# EAGLE design Skaarhoj BI10-2x5RGB (EAGLE 6.2)

## Sheet 1 of 2
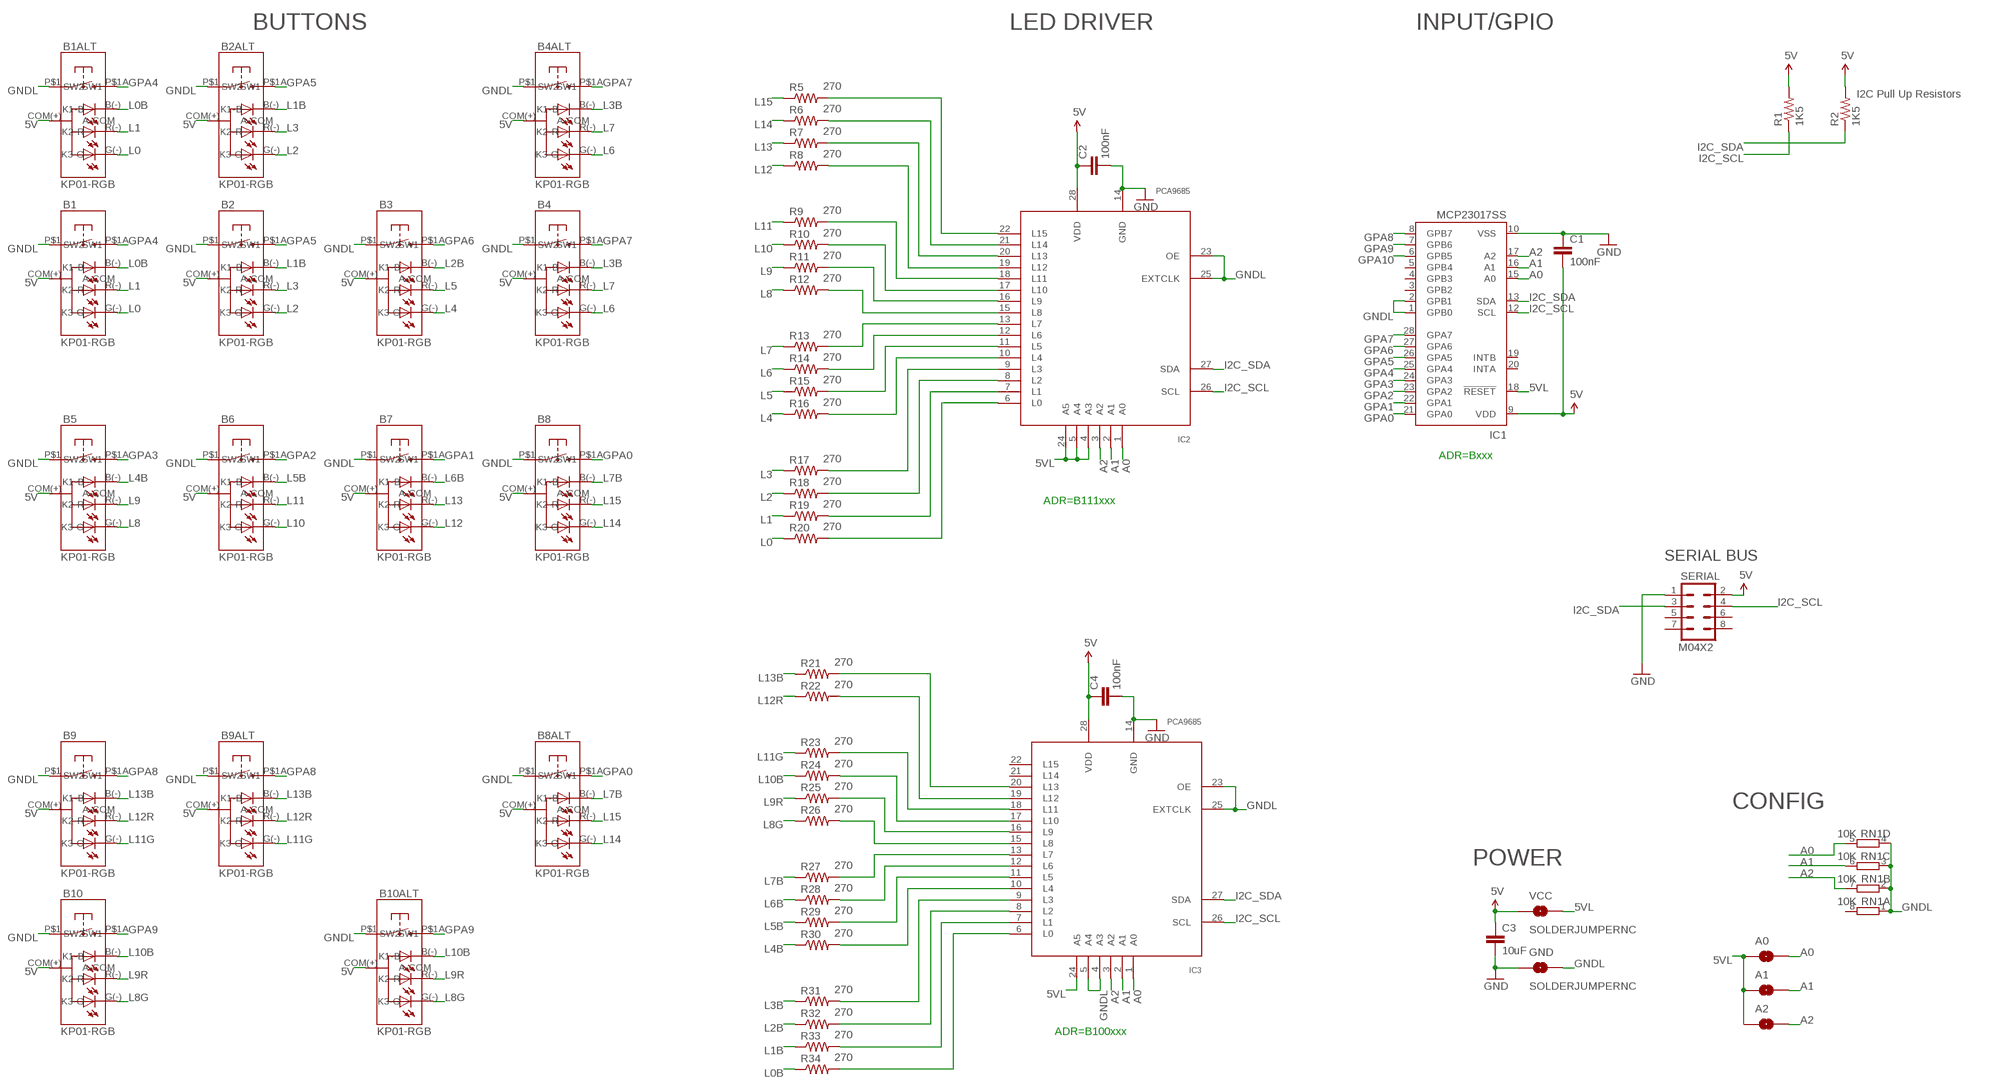
[diagram p0: schematic, sheet 1]

### Parts
A0  SOLDERJUMPERNC  [SJ_2S]
A1  SOLDERJUMPERNC  [SJ_2S]
A2  SOLDERJUMPERNC  [SJ_2S]
B1  KP01-RGB  NKK-KP01  [NKK-KP01]
B1ALT  KP01-RGB  NKK-KP01  [NKK-KP01]
B2  KP01-RGB  NKK-KP01  [NKK-KP01]
B2ALT  KP01-RGB  NKK-KP01  [NKK-KP01]
B3  KP01-RGB  NKK-KP01  [NKK-KP01]
B4  KP01-RGB  NKK-KP01  [NKK-KP01]
B4ALT  KP01-RGB  NKK-KP01  [NKK-KP01]
B5  KP01-RGB  NKK-KP01  [NKK-KP01]
B6  KP01-RGB  NKK-KP01  [NKK-KP01]
B7  KP01-RGB  NKK-KP01  [NKK-KP01]
B8  KP01-RGB  NKK-KP01  [NKK-KP01]
B8ALT  KP01-RGB  NKK-KP01  [NKK-KP01]
B9  KP01-RGB  NKK-KP01  [NKK-KP01]
B9ALT  KP01-RGB  NKK-KP01  [NKK-KP01]
B10  KP01-RGB  NKK-KP01  [NKK-KP01]
B10ALT  KP01-RGB  NKK-KP01  [NKK-KP01]
C1  100nF  CAP0603-CAP  [0603-CAP]
C2  100nF  CAP0603-CAP  [0603-CAP]
C3  10uF  CAP0805  [0805]
C4  100nF  CAP0603-CAP  [0603-CAP]
GND  SOLDERJUMPERNC  [SJ_2S]
IC1  MCP23017SS  [SSOP28]
IC2  PCA9685  [TSSOP28]
IC3  PCA9685  [TSSOP28]
R1  1K5  RESISTOR0603-RES  [0603-RES]
R2  1K5  RESISTOR0603-RES  [0603-RES]
R5  270  RESISTOR0603-RES  [0603-RES]
R6  270  RESISTOR0603-RES  [0603-RES]
R7  270  RESISTOR0603-RES  [0603-RES]
R8  270  RESISTOR0603-RES  [0603-RES]
R9  270  RESISTOR0603-RES  [0603-RES]
R10  270  RESISTOR0603-RES  [0603-RES]
R11  270  RESISTOR0603-RES  [0603-RES]
R12  270  RESISTOR0603-RES  [0603-RES]
R13  270  RESISTOR0603-RES  [0603-RES]
R14  270  RESISTOR0603-RES  [0603-RES]
R15  270  RESISTOR0603-RES  [0603-RES]
R16  270  RESISTOR0603-RES  [0603-RES]
R17  270  RESISTOR0603-RES  [0603-RES]
R18  270  RESISTOR0603-RES  [0603-RES]
R19  270  RESISTOR0603-RES  [0603-RES]
R20  270  RESISTOR0603-RES  [0603-RES]
R21  270  RESISTOR0603-RES  [0603-RES]
R22  270  RESISTOR0603-RES  [0603-RES]
R23  270  RESISTOR0603-RES  [0603-RES]
R24  270  RESISTOR0603-RES  [0603-RES]
R25  270  RESISTOR0603-RES  [0603-RES]
R26  270  RESISTOR0603-RES  [0603-RES]
R27  270  RESISTOR0603-RES  [0603-RES]
R28  270  RESISTOR0603-RES  [0603-RES]
R29  270  RESISTOR0603-RES  [0603-RES]
R30  270  RESISTOR0603-RES  [0603-RES]
R31  270  RESISTOR0603-RES  [0603-RES]
R32  270  RESISTOR0603-RES  [0603-RES]
R33  270  RESISTOR0603-RES  [0603-RES]
R34  270  RESISTOR0603-RES  [0603-RES]
RN1  10K  4R-NCAY16  [CAY16_HAND]
SERIAL  M04X2  [2X4]
VCC  SOLDERJUMPERNC  [SJ_2S]

### Nets
5V [Power]: B1.COM(+)(A-COM) B1ALT.COM(+)(A-COM) B2.COM(+)(A-COM) B2ALT.COM(+)(A-COM) B3.COM(+)(A-COM) B4.COM(+)(A-COM) B4ALT.COM(+)(A-COM) B5.COM(+)(A-COM) B6.COM(+)(A-COM) B7.COM(+)(A-COM) B8.COM(+)(A-COM) B8ALT.COM(+)(A-COM) B9.COM(+)(A-COM) B9ALT.COM(+)(A-COM) B10.COM(+)(A-COM) B10ALT.COM(+)(A-COM) C1.2 C2.1 C3.1 C4.1 IC1.9(VDD) IC2.28(VDD) IC3.28(VDD) R1.2 R2.2 SERIAL.2 VCC.1
5VL: A0.1 A1.1 A2.1 IC1.18(!RESET) IC2.4(A3) IC2.5(A4) IC2.24(A5) IC3.24(A5) VCC.2
A0: A0.2 IC1.15(A0) IC2.1(A0) IC3.1(A0) RN1.5
A1: A1.2 IC1.16(A1) IC2.2(A1) IC3.2(A1) RN1.6
A2: A2.2 IC1.17(A2) IC2.3(A2) IC3.3(A2) RN1.7
GND [Power]: C1.1 C2.2 C3.2 C4.2 GND.1 IC1.10(VSS) IC2.14(GND) IC3.14(GND) SERIAL.1
GNDL: B1.P$1(SW1) B1ALT.P$1(SW1) B2.P$1(SW1) B2ALT.P$1(SW1) B3.P$1(SW1) B4.P$1(SW1) B4ALT.P$1(SW1) B5.P$1(SW1) B6.P$1(SW1) B7.P$1(SW1) B8.P$1(SW1) B8ALT.P$1(SW1) B9.P$1(SW1) B9ALT.P$1(SW1) B10.P$1(SW1) B10ALT.P$1(SW1) GND.2 IC1.1(GPB0) IC1.2(GPB1) IC2.23(OE) IC2.25(EXTCLK) IC3.4(A3) IC3.5(A4) IC3.23(OE) IC3.25(EXTCLK) RN1.1 RN1.2 RN1.3 RN1.4
GPA0: B8.P$1A(SW2) B8ALT.P$1A(SW2) IC1.21(GPA0)
GPA1: B7.P$1A(SW2) IC1.22(GPA1)
GPA2: B6.P$1A(SW2) IC1.23(GPA2)
GPA3: B5.P$1A(SW2) IC1.24(GPA3)
GPA4: B1.P$1A(SW2) B1ALT.P$1A(SW2) IC1.25(GPA4)
GPA5: B2.P$1A(SW2) B2ALT.P$1A(SW2) IC1.26(GPA5)
GPA6: B3.P$1A(SW2) IC1.27(GPA6)
GPA7: B4.P$1A(SW2) B4ALT.P$1A(SW2) IC1.28(GPA7)
GPA8: B9.P$1A(SW2) B9ALT.P$1A(SW2) IC1.8(GPB7)
GPA9: B10.P$1A(SW2) B10ALT.P$1A(SW2) IC1.7(GPB6)
GPA10: IC1.6(GPB5)
I2C_SCL: IC1.12(SCL) IC2.26(SCL) IC3.26(SCL) R1.1 SERIAL.4
I2C_SDA: IC1.13(SDA) IC2.27(SDA) IC3.27(SDA) R2.1 SERIAL.3
L0: B1.G(-)(K3-G) B1ALT.G(-)(K3-G) R20.1
L0B: B1.B(-)(K1-B) B1ALT.B(-)(K1-B) R34.1
L1: B1.R(-)(K2-R) B1ALT.R(-)(K2-R) R19.1
L1B: B2.B(-)(K1-B) B2ALT.B(-)(K1-B) R33.1
L2: B2.G(-)(K3-G) B2ALT.G(-)(K3-G) R18.1
L2B: B3.B(-)(K1-B) R32.1
L3: B2.R(-)(K2-R) B2ALT.R(-)(K2-R) R17.1
L3B: B4.B(-)(K1-B) B4ALT.B(-)(K1-B) R31.1
L4: B3.G(-)(K3-G) R16.1
L4B: B5.B(-)(K1-B) R30.1
L5: B3.R(-)(K2-R) R15.1
L5B: B6.B(-)(K1-B) R29.1
L6: B4.G(-)(K3-G) B4ALT.G(-)(K3-G) R14.1
L6B: B7.B(-)(K1-B) R28.1
L7: B4.R(-)(K2-R) B4ALT.R(-)(K2-R) R13.1
L7B: B8.B(-)(K1-B) B8ALT.B(-)(K1-B) R27.1
L8: B5.G(-)(K3-G) R12.1
L8G: B10.G(-)(K3-G) B10ALT.G(-)(K3-G) R26.1
L9: B5.R(-)(K2-R) R11.1
L9R: B10.R(-)(K2-R) B10ALT.R(-)(K2-R) R25.1
L10: B6.G(-)(K3-G) R10.1
L10B: B10.B(-)(K1-B) B10ALT.B(-)(K1-B) R24.1
L11: B6.R(-)(K2-R) R9.1
L11G: B9.G(-)(K3-G) B9ALT.G(-)(K3-G) R23.1
L12: B7.G(-)(K3-G) R8.1
L12R: B9.R(-)(K2-R) B9ALT.R(-)(K2-R) R22.1
L13: B7.R(-)(K2-R) R7.1
L13B: B9.B(-)(K1-B) B9ALT.B(-)(K1-B) R21.1
L14: B8.G(-)(K3-G) B8ALT.G(-)(K3-G) R6.1
L15: B8.R(-)(K2-R) B8ALT.R(-)(K2-R) R5.1
N$2: IC3.13(L7) R27.2
N$3: IC3.12(L6) R28.2
N$4: IC2.13(L7) R13.2
N$5: IC2.12(L6) R14.2
N$6: IC3.11(L5) R29.2
N$7: IC2.11(L5) R15.2
N$9: IC2.10(L4) R16.2
N$10: IC2.9(L3) R17.2
N$11: IC2.8(L2) R18.2
N$12: IC2.7(L1) R19.2
N$13: IC3.10(L4) R30.2
N$14: IC3.9(L3) R31.2
N$15: IC3.8(L2) R32.2
N$16: IC3.7(L1) R33.2
N$17: IC3.6(L0) R34.2
N$18: IC3.15(L8) R26.2
N$19: IC2.6(L0) R20.2
N$20: IC2.15(L8) R12.2
N$21: IC2.16(L9) R11.2
N$22: IC2.17(L10) R10.2
N$23: IC2.18(L11) R9.2
N$24: IC2.19(L12) R8.2
N$25: IC2.20(L13) R7.2
N$26: IC2.21(L14) R6.2
N$27: IC2.22(L15) R5.2
N$28: IC3.16(L9) R25.2
N$29: IC3.17(L10) R24.2
N$30: IC3.18(L11) R23.2
N$31: IC3.19(L12) R22.2
N$32: IC3.20(L13) R21.2
Unconnected: IC1.3(GPB2) IC1.4(GPB3) IC1.5(GPB4) IC1.19(INTB) IC1.20(INTA) IC3.21(L14) IC3.22(L15) RN1.8 SERIAL.5 SERIAL.6 SERIAL.7 SERIAL.8

### Notes on the sheet
- BUTTONS | LED DRIVER | INPUT/GPIO
- I2C Pull Up Resistors
- ADR=Bxxx
- ADR=B111xxx
- SERIAL BUS
- CONFIG
- POWER
- ADR=B100xxx

## Sheet 2 of 2

## Library data of the parts
A0 A1 A2 GND VCC = SparkFun:SOLDERJUMPER: Solder Jumper Standard SMD solder jumper. Used to automate production. Two varients : Normally Open and Normally Closed are the same, but have different paste layers. NC will have a large amount of paste and should jumper during reflow.
B1 B1ALT B2 B2ALT B3 B4 B4ALT B5-B8 B8ALT B9 B9ALT B10 B10ALT = SKAARHOJ:NKK-KP01: NKK-KP01-15AC 100mA12VDC
C1-C4 = SparkFun:CAP: Capacitor Standard 0603 ceramic capacitor, and 0.1" leaded capacitor.
IC1 = microchip:MCP23017: http://ww1.microchip.com/downloads/en/DeviceDoc/21952a.pdf Source: http://ww1.microchip.com/downloads/en/DeviceDoc/21952a.pdf; MF: MICROCHIP; MPN: MCP23017-E/SS; OC_FARNELL: 1467674; OC_NEWARK: 31K2960
IC2 IC3 = wsmith:PCA9685
R1 R2 R5-R34 = SparkFun:RESISTOR: Resistor Basic schematic elements and footprints for 0603, 1206, and PTH resistors.
RN1 = SKAARHOJ:4R-N: Array Chip Resistor Source: RS Component / Phycomp; OC_FARNELL: unknown; OC_NEWARK: unknown
SERIAL = SparkFun:M04X2

## Net classes
0 default: width 0.152 mm, drill 0.254 mm, clearance 0.152 mm
1 Power: width 0.406 mm, drill 0.61 mm, clearance 0.203 mm

## Board
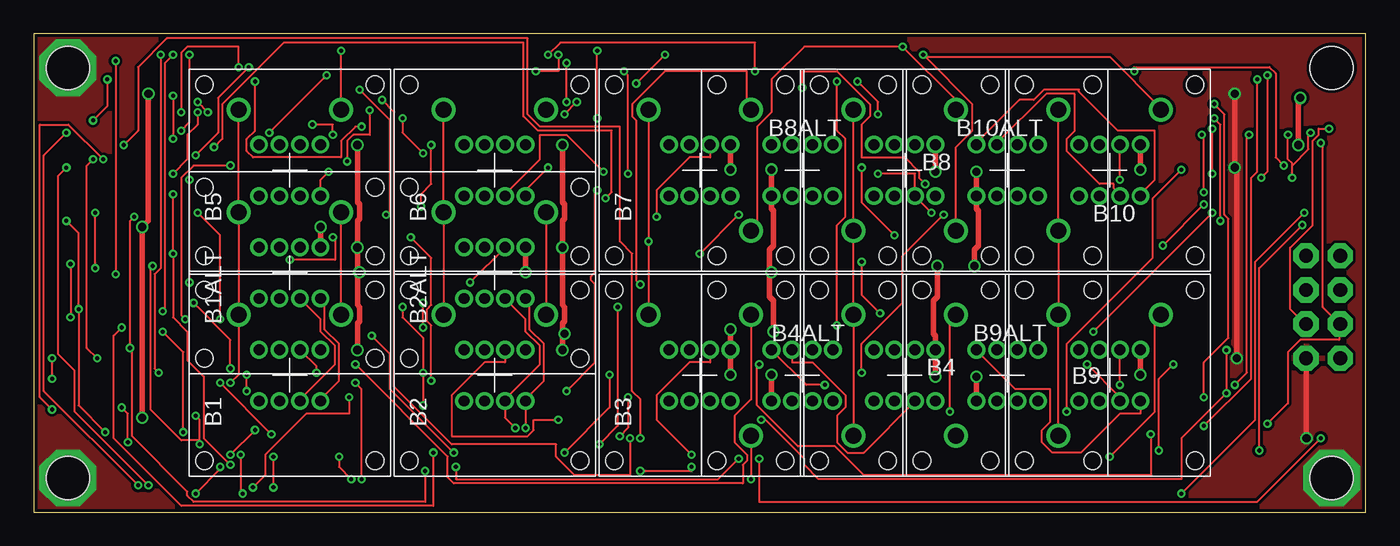
[diagram p1: board, top side]
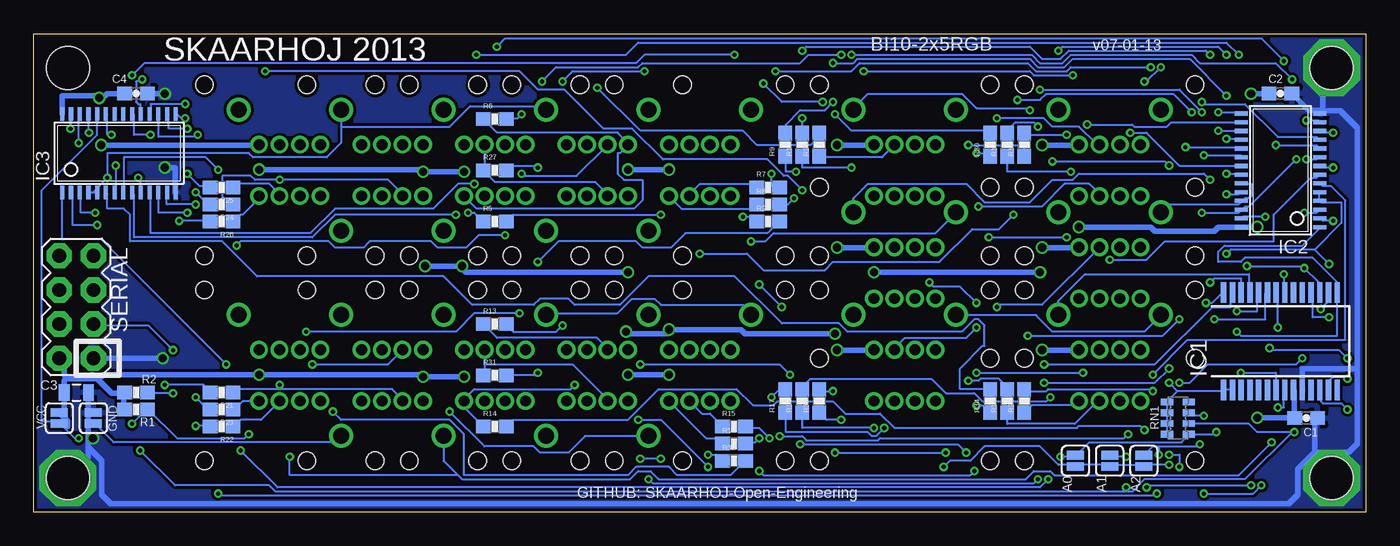
[diagram p2: board, bottom side, seen from below]

Size 99.06 x 35.56 mm. Coordinates in mm from the lower left corner, seen from the top.
Outline: 0,0 99.06,0 99.06,35.56 0,35.56 0,0
Copper layers (1*16): Top 0.035mm / dielectric 1.5mm / Bottom 0.035mm
Design rules: minimum track width 6mil, minimum drill 12mil, track to track 6mil, track to pad 6mil, pad to pad 6mil, via to via 6mil, smd to smd 0mil, copper to edge 10mil, drill to drill 10mil, minimum pad ring 10mil, minimum via ring 6mil, stop-mask expansion 2mil, vias tented up to drill 100mil, thermal gap 10mil
Holes 3.2 mm at 2.54,2.54 2.54,33.02 96.52,33.02 96.52,2.54

### Footprints (pad centres in the part's own frame; a part is rotated, then mirrored left to right if it is on the bottom)
SJ_2S = smd 0.635 x 1.27: 1 -0.412,0; 2 0.412,0
NKK-KP01 = drill 0.8: B(-) 1.905,-0.762; COM(+) 1.905,-2.286; G(-) -1.905,-2.286; P$3 1.905,0.762; P$4 1.905,2.286; P$7 -1.905,0.762; P$8 -1.905,2.286; R(-) -1.905,-0.762 | drill 1.2: P$1 4.496,3.81; P$1A 4.496,-3.81 | hole 1.3: -6.35,6.35; 6.35,6.35; 6.35,-6.35; -6.35,-6.35
0603-CAP = smd 1.1 x 1: 1 -0.85,0; 2 0.85,0
0805 = smd 0.8 x 1.2: 1 -0.9,0; 2 0.9,0
SSOP28 = smd 0.4 x 1.5: 1 -4.225,-3.625; 2 -3.575,-3.625; 3 -2.925,-3.625; 4 -2.275,-3.625; 5 -1.625,-3.625; 6 -0.975,-3.625; 7 -0.325,-3.625; 8 0.325,-3.625; 9 0.975,-3.625; 10 1.625,-3.625; 11 2.275,-3.625; 12 2.925,-3.625; 13 3.575,-3.625; 14 4.225,-3.625; 15 4.225,3.625; 16 3.575,3.625; 17 2.925,3.625; 18 2.275,3.625; 19 1.625,3.625; 20 0.975,3.625; 21 0.325,3.625; 22 -0.325,3.625; 23 -0.975,3.625; 24 -1.625,3.625; 25 -2.275,3.625; 26 -2.925,3.625; 27 -3.575,3.625; 28 -4.225,3.625
TSSOP28 = smd 0.305 x 0.991: 1 -4.225,-2.918; 2 -3.575,-2.918; 3 -2.925,-2.918; 4 -2.275,-2.918; 5 -1.625,-2.918; 6 -0.975,-2.918; 7 -0.325,-2.918; 8 0.325,-2.918; 9 0.975,-2.918; 10 1.625,-2.918; 11 2.275,-2.918; 12 2.925,-2.918; 13 3.575,-2.918; 14 4.225,-2.918; 15 4.225,2.918; 16 3.575,2.918; 17 2.925,2.918; 18 2.275,2.918; 19 1.625,2.918; 20 0.975,2.918; 21 0.325,2.918; 22 -0.325,2.918; 23 -0.975,2.918; 24 -1.625,2.918; 25 -2.275,2.918; 26 -2.925,2.918; 27 -3.575,2.918; 28 -4.225,2.918
0603-RES = smd 1.1 x 1: 1 -0.85,0; 2 0.85,0
CAY16_HAND = smd 0.5 x 0.904: 1 -1.2,-0.813; 2 -0.4,-0.813; 3 0.4,-0.813; 4 1.2,-0.813; 5 1.2,0.813; 6 0.4,0.813; 7 -0.4,0.813; 8 -1.2,0.813
2X4 = drill 1.016 pad 1.88 octagon: 1 -3.81,-1.27; 2 -3.81,1.27; 3 -1.27,-1.27; 4 -1.27,1.27; 5 1.27,-1.27; 6 1.27,1.27; 7 3.81,-1.27; 8 3.81,1.27

### Placement (x,y rotation side)
A0  21.59,3.81 90 bottom
A1  19.05,3.81 90 bottom
A2  16.51,3.81 90 bottom
B1  19.05,10.16 90 top
B1ALT  19.05,17.78 90 top
B2  34.29,10.16 90 top
B2ALT  34.29,17.78 90 top
B3  49.53,10.16 90 top
B4  64.77,10.16 90 top
B4ALT  57.15,10.16 270 top
B5  19.05,25.4 90 top
B6  34.29,25.4 90 top
B7  49.53,25.4 90 top
B8  64.77,25.4 90 top
B8ALT  57.15,25.4 270 top
B9  80.01,10.16 90 top
B9ALT  72.39,10.16 270 top
B10  80.01,25.4 90 top
B10ALT  72.39,25.4 270 top
C1  4.45,6.99 180 bottom
C2  6.35,31.11 0 bottom
C3  95.89,8.89 0 bottom
C4  91.44,31.11 0 bottom
GND  94.61,6.99 270 bottom
IC1  6.35,12.7 0 bottom
IC2  6.35,25.4 90 bottom
IC3  92.71,26.67 0 bottom
R1  91.44,7.62 180 bottom
R2  91.44,8.89 180 bottom
R5  64.77,21.59 0 bottom
R6  64.77,29.21 0 bottom
R7  44.45,24.13 0 bottom
R8  44.45,22.86 0 bottom
R9  43.18,27.3 90 bottom
R10  41.91,27.3 90 bottom
R11  25.4,27.3 90 bottom
R12  26.67,27.3 90 bottom
R13  64.77,13.97 0 bottom
R14  64.77,6.35 0 bottom
R15  46.99,6.35 0 bottom
R16  46.99,5.08 0 bottom
R17  43.18,8.26 90 bottom
R18  41.91,8.26 90 bottom
R19  26.67,8.26 90 bottom
R20  25.4,8.26 90 bottom
R21  85.09,8.89 180 bottom
R22  85.09,6.35 180 bottom
R23  85.09,7.62 180 bottom
R24  85.09,22.86 180 bottom
R25  85.09,24.13 180 bottom
R26  85.09,21.59 180 bottom
R27  64.77,25.4 0 bottom
R28  44.45,21.59 0 bottom
R29  40.64,27.3 90 bottom
R30  27.94,27.3 90 bottom
R31  64.77,10.16 0 bottom
R32  46.99,3.81 0 bottom
R33  40.64,8.26 90 bottom
R34  27.94,8.26 90 bottom
RN1  13.97,6.99 270 bottom
SERIAL  95.89,15.24 90 bottom
VCC  97.16,6.99 270 bottom

### Tracks (layer width: path | path; a pad name or v marks a point on that pad's centre or on a via)
5V  (via drill 0.61)
  Top 0.406: v24.08,12.04 24.08,14.02 24.23,14.17 24.23,15.24 24.08,15.39 24.08,17.83 | 24.08,17.83 v24.08,19.66 24.08,21.64 24.23,21.79 24.23,22.86 24.08,23.01 v24.08,27.28 | v8.53,31.09 8.53,21.64 v8.08,21.18 v8.08,7.01 | v21.34,21.18 B1ALT.COM(+) | v54.86,25.45 B8ALT.COM(+) 54.86,22.55 55.02,22.4 55.02,19.81 54.71,19.51 54.71,17.83 | B7.COM(+) v51.82,25.45 | v54.86,10.21 B4ALT.COM(+) | v51.82,10.21 B3.COM(+) v51.82,13.56 | 39.32,13.26 39.32,14.02 39.47,14.17 39.47,15.24 39.32,15.39 v39.32,19.66 39.32,21.64 39.47,21.79 39.47,22.86 39.32,23.01 v39.32,27.28 | 39.32,13.26 v39.32,12.04 | v39.47,13.26 39.32,13.26 | 54.71,17.83 54.71,16 55.02,15.7 v55.02,13.41 | v70.1,10.06 B9ALT.COM(+) | v67.06,10.06 B4.COM(+) 67.06,13.11 66.9,13.26 66.9,15.7 67.21,16 v67.21,18.29 | v82.3,10.21 B9.COM(+) | v70.1,25.3 B10ALT.COM(+) 70.1,22.55 70.26,22.4 70.26,19.81 69.95,19.51 v69.95,18.29 | B8.COM(+) v67.06,25.3 | v82.3,25.45 B10.COM(+) | v94.18,30.79 94.03,30.79 v94.03,27.28 | v54.86,17.83 54.71,17.83 | B2ALT.COM(+) v36.58,17.83 | v24.23,17.83 24.08,17.83
  Bottom 0.406: v24.08,12.04 21.34,12.04 B1.COM(+) | v24.08,19.66 21.34,19.66 B1ALT.COM(+) | v24.08,27.28 21.34,27.28 B5.COM(+) | IC1.9 5.33,8.99 5.33,7.01 C1.2 5.49,7.01 v8.08,7.01 | v8.08,21.18 9.14,21.18 IC2.28 9.45,21.18 10.97,21.18 11.28,20.88 15.7,20.88 16,21.18 v21.34,21.18 | v8.53,31.09 7.32,31.09 C2.1 | v51.82,25.45 v54.86,25.45 | v51.82,10.21 v54.86,10.21 | v39.32,12.04 36.58,12.04 B2.COM(+) | v39.32,19.66 36.58,19.66 B2ALT.COM(+) | v39.32,27.28 36.58,27.28 B6.COM(+) | v39.47,13.26 46.18,13.26 46.48,13.56 v51.82,13.56 51.82,13.41 51.97,13.26 54.86,13.26 v55.02,13.41 | R1.2 92.35,7.62 92.35,8.84 R2.2 92.51,8.84 93.27,8.84 94.34,9.91 | 96.77,7.47 97.08,7.47 VCC.1 96.52,6.76 96.52,6.35 96.77,6.6 96.77,8.84 C3.1 96.77,8.99 96.77,9.75 96.62,9.91 | 96.62,9.91 94.34,9.91 | SERIAL.2 96.77,11.43 96.77,10.21 96.62,10.06 96.62,9.91 | v67.06,10.06 v70.1,10.06 70.1,10.21 v82.3,10.21 93.88,10.21 94.03,10.06 94.34,10.06 94.34,9.91 | 94.18,30.94 93.73,30.94 93.57,31.09 92.35,31.09 C4.1 | 94.18,30.94 96.93,30.94 96.93,29.72 IC3.28 | v67.06,25.3 v70.1,25.3 70.1,25.45 v82.3,25.45 | v94.03,27.28 82.3,27.28 B10.COM(+) | v94.18,30.79 94.18,30.94 | v69.95,18.29 v67.21,18.29 67.21,18.14 66.9,17.83 v54.86,17.83 | v36.58,17.83 v24.23,17.83
5VL  (via drill 0.3)
  Top 0.152: v10.36,23.62 v10.36,19.2 10.36,14.48 11.43,13.41 11.43,11.28 12.65,10.06 12.65,5.49 v14.63,3.5 | v2.74,18.44 v2.74,14.48 | v95.71,5.49 90.98,0.76 53.95,0.76 v53.95,3.96 | v52.43,3.96 50.9,2.44 31.39,2.44 v31.39,3.35
  Bottom 0.152: IC3.24 94.34,29.57 94.34,28.04 98.45,23.93 98.45,6.71 97.23,6.71 VCC.2 97.08,6.55 96.01,5.49 v95.71,5.49 | 19.05,3.5 16.61,3.5 A2.1 16.46,3.5 v14.63,3.5 | 19.05,3.5 21.49,3.5 A0.1 21.64,3.5 22.86,3.5 24.23,4.88 28.35,4.88 29.41,3.81 30.94,3.81 v31.39,3.35 | 19.05,3.5 A1.1 | IC2.5 3.5,23.77 3.5,23.16 IC2.4 3.35,23.01 1.83,23.01 1.83,21.49 3.81,19.51 | v10.36,23.62 9.45,23.62 9.3,23.77 IC2.24 | v10.36,19.2 10.06,19.51 3.81,19.51 | v2.74,14.48 3.96,14.48 3.96,16.31 IC1.18 | 3.81,19.51 v2.74,18.44 | v52.43,3.96 v53.95,3.96
A0  (via drill 0.3)
  Top 0.152: v84.73,10.97 83.67,9.91 v83.67,4.57 | v23.62,2.44 22.71,3.35 v22.71,4.12 | v9.6,13.41 11.12,11.89 v11.12,5.94
  Bottom 0.152: IC2.1 3.5,21.03 4.72,19.81 10.52,19.81 10.97,19.36 10.97,18.59 9.3,18.59 8.99,18.9 3.96,18.9 2.13,17.07 2.13,16.46 IC1.15 2.13,16.31 2.13,13.11 9.3,13.11 v9.6,13.41 | v84.73,10.97 94.03,20.27 96.93,20.27 96.93,23.62 IC3.1 | v83.67,4.57 80.92,1.83 24.23,1.83 v23.62,2.44 | v22.71,4.12 21.64,4.12 A0.2 21.49,4.27 20.57,5.18 13.72,5.18 13.26,5.64 RN1.5 13.11,5.79 11.28,5.79 v11.12,5.94
A1  (via drill 0.3)
  Top 0.152: v5.33,5.94 3.35,7.92 v3.35,15.09 3.35,20.73 v2.44,21.64 | v94.34,21.34 91.14,18.14 v91.14,4.57 | v17.83,1.83 v17.83,4.12
  Bottom 0.152: 5.49,5.94 8.08,5.94 8.69,6.55 13.11,6.55 RN1.6 | v3.35,15.09 2.9,15.54 2.9,16.31 IC1.16 | v2.44,21.64 3.2,21.64 3.35,21.79 IC2.2 | v94.34,21.34 96.16,21.34 96.16,23.62 IC3.2 | v91.14,4.57 88.54,1.98 81.53,1.98 81.08,1.52 17.83,1.52 | 17.83,1.52 17.37,1.52 16.46,2.44 8.99,2.44 5.49,5.94 | 5.49,5.94 v5.33,5.94 | v17.83,4.12 19.05,4.12 A1.2 | 17.83,1.52 v17.83,1.83
A2  (via drill 0.3)
  Top 0.152: v4.57,18.14 v4.57,22.25 | v12.04,7.16 12.34,6.86 12.34,5.33 | v12.34,5.03 12.34,5.33 | v94.49,22.25 90.83,18.59 90.83,6.86 v85.34,1.37 | v15.54,1.37 15.39,1.52 v15.39,4.27 | v8.84,18.29 8.69,18.14 8.69,7.62 10.97,5.33 12.34,5.33
  Bottom 0.152: v4.57,22.25 3.66,22.25 3.5,22.4 IC2.3 | IC1.17 3.5,16.46 3.5,17.07 v4.57,18.14 4.72,18.29 v8.84,18.29 | v12.04,7.16 12.95,7.16 13.11,7.32 RN1.7 | v12.34,5.03 12.5,4.88 15.39,4.88 | 15.39,4.88 15.85,4.88 16.46,4.27 A2.2 | v94.49,22.25 95.56,22.25 95.56,23.62 IC3.3 | v85.34,1.37 85.19,1.22 15.7,1.22 v15.54,1.37 | 15.39,4.88 v15.39,4.27
GND  (via drill 0.61, 3.2)
  Top 0.406: v89.31,31.09 v89.31,25.6 89.31,25.45 89.46,25.3 v89.46,11.43 | v94.64,5.49 94.64,11.43 SERIAL.1
  Bottom 0.406: C3.2 94.98,7.47 | 94.98,7.47 94.98,5.49 | 94.98,5.49 94.98,4.82 | 94.98,4.82 93.98,3.81 93.98,1.27 93.34,0.64 5.71,0.64 5.08,1.27 5.08,3.17 3.81,4.45 | 3.81,4.45 1.27,4.45 0.64,5.08 0.64,10.67 | 0.64,10.67 0.64,28.57 1.91,29.84 3.21,29.84 | 3.21,29.84 IC2.14 | 3.81,4.45 3.81,6.77 C1.1 | v89.31,25.6 88.54,25.6 88.54,23.77 IC3.14 | v89.31,31.09 90.53,31.09 C4.2 | C2.2 5.49,31.09 4.27,29.87 3.35,29.87 3.21,29.84 | GND.1 94.64,7.47 94.98,7.47 | 0.64,10.67 4.72,10.67 4.72,9.14 IC1.10 | v94.64,5.49 94.98,5.49 | SERIAL.1 v89.46,11.43 | 94.98,4.82 94.98,4.08 v96.52,2.54 | 3.81,4.45 3.81,3.81 v2.54,2.54 | 3.21,29.84 3.21,32.35 v2.54,33.02
  pour Bottom: 0,0 0,35.56 99.06,35.56 99.06,0
  pour Top: 0,0 0,35.56 99.06,35.56 99.06,0
GNDL  (via drill 0.3)
  Top 0.152: B2.P$1 B2ALT.P$1 B6.P$1 | B5.P$1 B1ALT.P$1 B1.P$1 15.24,10.21 v14.63,9.6 | B7.P$1 v45.72,20.12 B3.P$1 | B4ALT.P$1 B4.P$1 B8ALT.P$1 B8.P$1 | v93.27,28.04 93.27,26.21 93.57,25.91 93.57,25.76 | v93.57,24.84 93.57,25.76 | v94.94,28.19 94.79,28.04 94.79,26.98 93.57,25.76 | B9ALT.P$1 B9.P$1 B10ALT.P$1 B10.P$1
  Bottom 0.152: RN1.4 RN1.3 RN1.2 RN1.1 14.78,8.23 14.02,8.99 | IC1.2 10.06,9.14 10.52,9.14 IC1.1 10.67,8.99 14.02,8.99 | IC2.23 9.14,24.38 8.53,24.38 8.53,23.47 8.69,23.32 8.99,23.32 9.14,23.16 IC2.25 9.3,23.01 9.45,22.86 14.78,22.86 15.24,22.4 B1ALT.P$1 | v14.63,9.6 14.02,8.99 | B2.P$1 30.48,14.63 24.54,14.63 23.32,13.41 16.46,13.41 15.24,14.63 B1.P$1 | B3.P$1 45.72,14.78 46.33,15.39 52.43,15.39 52.88,15.85 54.56,15.85 55.63,14.78 60.96,14.78 B4.P$1 | 94.64,23.77 94.94,23.77 IC3.4 | 94.64,23.77 94.34,23.77 IC3.5 | v93.27,28.04 93.57,28.04 93.57,29.57 IC3.23 | 94.64,23.77 v93.57,24.84 93.57,26.67 83.06,26.67 82.75,26.36 77.27,26.36 76.2,27.43 76.2,28.65 | v94.94,28.19 94.94,29.57 IC3.25 | B10.P$1 76.2,28.65 | GND.2 94.49,6.55 93.12,5.18 76.66,5.18 76.2,5.64 B9ALT.P$1 | 76.2,28.65 68.12,28.65 66.6,30.18 61.11,30.18 60.96,30.02 B8.P$1 | v45.72,20.12 44.65,20.12 44.04,20.73 32,20.73 30.48,22.25 B2ALT.P$1
GPA0  (via drill 0.3)
  Top 0.152: v6.1,33.53 v6.1,17.68 | B8.P$1A 68.58,30.63 v64.62,34.59 57.3,34.59 54.86,32.16 54.86,29.72 53.8,28.65 53.8,21.49 53.34,21.03 B8ALT.P$1A
  Bottom 0.152: v6.1,17.68 6.1,16.46 IC1.21 | v6.1,33.53 7.77,35.2 64.01,35.2 v64.62,34.59
GPA1  (via drill 0.3)
  Top 0.152: v6.55,13.72 5.94,13.11 5.94,5.49 10.97,0.46 29.72,0.46 v29.72,4.42 | v42.06,5.03 43.43,6.4 v43.43,15.24 | v45.11,16.92 44.81,17.22 44.81,29.11 44.5,29.41 44.5,30.33 46.94,32.77 53.03,32.77 53.03,30.33 53.34,30.02 B7.P$1A
  Bottom 0.152: v6.55,13.72 6.55,16.31 IC1.22 | v29.72,4.42 30.33,5.03 v42.06,5.03 | v45.11,16.92 v43.43,15.24
GPA2  (via drill 0.3)
  Top 0.152: v11.28,14.33 10.97,14.63 10.97,24.84 11.89,25.76 v14.63,25.76 | v23.32,26.06 23.32,27.58 23.77,28.04 24.99,28.04 v24.99,29.87
  Bottom 0.152: v11.28,14.33 7.47,14.33 7.47,16.31 IC1.23 | v14.63,25.76 14.94,26.06 v23.32,26.06 | v24.99,29.87 25.15,30.02 28.96,30.02 30.02,31.09 37.03,31.09 38.1,30.02 B6.P$1A
GPA3  (via drill 0.3)
  Top 0.152: v9.6,14.94 9.75,15.09 9.75,33.38 v10.36,33.98 | B5.P$1A v22.86,34.29
  Bottom 0.152: v9.6,14.94 8.08,14.94 8.08,16.31 IC1.24 | v10.36,33.98 10.97,34.59 22.55,34.59 v22.86,34.29
GPA4
  Top 0.152: B1.P$1A B1ALT.P$1A
  Bottom 0.152: B1.P$1A 22.86,15.7 20.88,17.68 8.69,17.68 8.69,16.46 IC1.25
GPA5  (via drill 0.3)
  Top 0.152: v11.58,24.69 v11.58,17.07 | B2ALT.P$1A B2.P$1A
  Bottom 0.152: v11.58,17.07 11.28,17.37 9.3,17.37 9.3,16.46 IC1.26 | v11.58,24.69 12.04,25.15 21.34,25.15 21.79,24.69 23.32,24.69 24.99,23.01 28.35,23.01 29.72,24.38 37.03,24.38 38.1,23.32 B2ALT.P$1A
GPA6  (via drill 0.3)
  Top 0.152: v23.93,10.97 30.79,4.12 30.79,2.59 31.24,2.13 52.73,2.13 52.73,3.5 53.03,3.81 53.03,4.27 52.12,5.18 52.12,7.16 53.34,8.38 B3.P$1A
  Bottom 0.152: v23.93,10.97 15.7,10.97 11.43,15.24 10.06,15.24 10.06,16.31 IC1.27
GPA7  (via drill 0.3)
  Top 0.152: v11.89,15.54 14.63,12.8 v14.63,10.67 | v23.93,9.6 24.38,9.14 v24.38,2.44 | B4ALT.P$1A v53.34,2.44 | v68.12,7.47 68.12,14.17 68.58,14.63 B4.P$1A
  Bottom 0.152: v11.89,15.54 11.43,15.54 10.67,16.31 IC1.28 | v14.63,10.67 15.7,9.6 v23.93,9.6 | v24.38,2.44 24.69,2.13 53.03,2.13 v53.34,2.44 | v68.12,7.47 65.53,4.88 61.87,4.88 61.42,4.42 59.28,4.42 58.06,5.64 53.34,5.64 B4ALT.P$1A
GPA8  (via drill 0.3)
  Top 0.152: v6.55,7.77 7.01,7.32 v7.01,5.18 | v80.01,4.12 83.36,7.47 83.36,14.17 83.82,14.63 B9.P$1A
  Bottom 0.152: v6.55,7.77 6.1,7.77 6.1,8.99 IC1.8 | v7.01,5.18 9.45,2.74 23.16,2.74 23.47,3.05 24.69,3.05 25.3,2.44 52.58,2.44 53.19,3.05 54.1,3.05 54.71,2.44 67.21,2.44 67.51,2.74 | 67.51,2.74 68.58,3.81 B9ALT.P$1A | v80.01,4.12 80.01,2.74 67.51,2.74
GPA9  (via drill 0.3)
  Top 0.152: v9.3,10.36 8.99,10.67 8.99,17.68 9.45,18.14 v9.45,33.98 | 66.29,33.83 69.8,30.33 69.8,28.35 68.58,27.13 B10ALT.P$1A | 66.29,33.83 80.01,33.83 83.82,30.02 B10.P$1A | 66.29,33.83 v66.14,33.98
  Bottom 0.152: v9.3,10.36 6.71,10.36 6.71,9.14 IC1.7 | v9.45,33.98 10.36,34.9 54.1,34.9 55.02,33.98 v66.14,33.98
I2C_SCL  (via drill 0.3)
  Top 0.152: v5.18,26.21 2.59,28.8 0.46,28.8 0.46,8.53 v1.37,7.62 | v95.71,27.43 95.86,27.28 95.86,15.24 97.08,14.02 SERIAL.4 97.08,13.87 97.08,12.8 94.18,12.8 93.27,11.89 93.27,8.08 v91.75,6.55 | v12.19,22.25 13.87,20.57 v13.87,14.33 | v25.15,13.11 26.52,11.73 26.52,9.14 v31.24,4.42 | v39.47,4.42 42.82,7.77 v42.82,10.21 | v53.95,10.97 53.8,10.82 53.8,7.92 56.84,4.88 59.59,4.88 61.72,2.74 83.06,2.74 v83.06,5.79
  Bottom 0.152: v5.18,26.21 8.69,22.71 8.99,22.71 9.14,22.55 IC2.26 9.3,22.4 9.45,22.25 v12.19,22.25 | v1.37,7.62 1.83,8.08 3.2,8.08 3.35,8.23 3.35,8.99 IC1.12 | v95.71,27.43 95.71,29.57 IC3.26 | v91.75,6.55 90.68,7.62 R1.1 90.53,7.62 88.39,5.49 83.36,5.49 v83.06,5.79 | v13.87,14.33 15.09,13.11 v25.15,13.11 | v39.47,4.42 v31.24,4.42 | v42.82,10.21 43.59,10.97 v53.95,10.97
I2C_SDA  (via drill 0.3)
  Top 0.152: v7.47,21.95 7.16,21.64 v7.16,12.19 7.32,12.04 7.32,5.64 11.43,1.52 11.43,1.22 11.89,0.76 29.11,0.76 v29.11,3.05 | v1.37,9.91 v1.37,11.43 | v96.32,28.5 95.56,28.5 95.56,28.04 95.1,27.58 95.1,21.34 93.42,19.66 93.42,15.09 94.49,14.02 SERIAL.3 | v88.7,12.04 v88.7,8.84 85.34,5.49 85.34,2.44 58.37,2.44 57.3,3.5 57.3,3.96 54.41,6.86 v54.1,6.86 | v45.11,3.05 48.92,3.05 v48.92,3.35
  Bottom 0.152: v7.47,21.95 9.14,21.95 IC2.27 | v7.16,12.19 7.01,12.04 1.98,12.04 v1.37,11.43 | v1.37,9.91 1.52,10.06 2.44,10.06 2.74,9.75 2.74,9.14 IC1.13 | v96.32,28.5 96.32,29.57 IC3.27 | v88.7,8.84 90.53,8.84 R2.1 | v88.7,12.04 90.53,13.87 94.49,13.87 SERIAL.3 | v29.11,3.05 29.41,2.74 44.81,2.74 v45.11,3.05 | v48.92,3.35 52.43,6.86 v54.1,6.86
L0
  Top 0.152: B1ALT.G(-) 21.34,15.85 21.64,15.54 21.64,13.56 22.71,12.5 22.71,9.75 21.34,8.38 B1.G(-)
  Bottom 0.152: R20.1 25.3,7.47 24.84,7.92 21.64,7.92 21.34,8.23 B1.G(-)
L0B  (via drill 0.3)
  Top 0.152: v28.96,7.92 v28.96,10.36 28.96,12.95 27.43,14.48 v27.43,15.24 | v21.03,10.36 21.03,10.82 19.81,12.04 B1.B(-)
  Bottom 0.152: v28.96,7.92 28.5,7.92 28.04,7.47 R34.1 | v27.43,15.24 27.28,15.39 24.08,15.39 19.81,19.66 B1ALT.B(-) | v28.96,10.36 v21.03,10.36
L1
  Top 0.152: B1ALT.R(-) 19.81,15.85 21.34,14.33 21.34,13.41 22.4,12.34 22.4,10.97 19.81,8.38 B1.R(-)
  Bottom 0.152: R19.1 26.67,6.55 21.64,6.55 19.96,8.23 19.81,8.23 B1.R(-)
L1B  (via drill 0.3)
  Top 0.152: v39.01,6.86 37.19,6.86 37.19,6.1 36.73,5.64 31.09,5.64 31.09,8.69 33.53,11.12 35.05,11.12 B2.B(-) | v32.46,17.07 35.05,19.66 B2ALT.B(-) | v28.96,13.72 v28.96,15.54
  Bottom 0.152: v39.01,6.86 40.08,6.86 40.54,7.32 R33.1 | v32.46,17.07 32.16,16.76 30.18,16.76 v28.96,15.54 | v28.96,13.72 29.72,12.95 34.29,12.95 35.05,12.19 B2.B(-)
L2  (via drill 0.3)
  Top 0.152: v36.58,6.25 B2.G(-) 36.58,8.38 37.95,9.75 37.95,12.5 36.88,13.56 36.88,15.54 36.58,15.85 B2ALT.G(-)
  Bottom 0.152: R18.1 41.91,6.25 v36.58,6.25
L2B  (via drill 0.3)
  Top 0.152: v48.92,4.27 46.33,6.86 46.33,8.69 48.77,11.12 50.29,11.12 B3.B(-)
  Bottom 0.152: v48.92,4.27 48.31,4.27 47.85,3.81 R32.1
L3  (via drill 0.3)
  Top 0.152: v35.81,6.25 35.05,7.01 B2.R(-) 35.05,8.38 37.64,10.97 37.64,12.34 36.58,13.41 36.58,14.33 35.05,15.85 B2ALT.R(-)
  Bottom 0.152: v35.81,6.25 36.42,5.64 36.73,5.64 37.03,5.94 43.13,5.94 43.13,7.32 R17.1
L3B
  Bottom 0.152: B4.B(-) 65.53,10.97 | 65.53,10.97 65.53,10.21 R31.1 | 65.53,10.97 58.98,10.97 56.39,8.38 B4ALT.B(-)
L4
  Bottom 0.152: R16.1 47.85,5.18 48.16,5.49 49.07,5.49 51.82,8.23 B3.G(-)
L4B  (via drill 0.3)
  Top 0.152: v28.96,26.67 27.43,28.19 v27.43,29.26
  Bottom 0.152: v28.96,26.67 28.19,26.67 28.04,26.52 R30.1 | v27.43,29.26 23.93,29.26 23.32,28.65 21.34,28.65 20.12,27.43 19.81,27.43 B5.B(-)
L5
  Bottom 0.152: R15.1 47.85,6.4 48.77,7.32 49.38,7.32 50.29,8.23 B3.R(-)
L5B
  Bottom 0.152: R29.1 40.54,26.36 35.97,26.36 35.05,27.28 B6.B(-)
L6  (via drill 0.3)
  Top 0.152: v58.83,9.45 57.45,9.45 54.86,12.04 B4ALT.G(-)
  Bottom 0.152: R14.1 65.68,6.4 67.06,7.77 B4.G(-) 67.06,8.38 66.29,9.14 59.13,9.14 v58.83,9.45
L6B  (via drill 0.3)
  Top 0.152: v46.33,21.95 46.33,23.93 48.77,26.36 50.29,26.36 B7.B(-)
  Bottom 0.152: v46.33,21.95 45.72,21.95 45.41,21.64 R28.1
L7
  Top 0.152: B4ALT.R(-) 56.39,11.12 57.91,11.12 60.35,8.69 60.35,7.77 59.74,7.16 59.74,5.18 60.5,4.42 61.72,4.42 65.53,8.23 B4.R(-)
  Bottom 0.152: R13.1 65.53,13.87 64.62,12.95 57.15,12.95 56.39,12.19 B4ALT.R(-)
L7B
  Bottom 0.152: B8.B(-) 65.53,25.45 R27.1 65.53,25.3 64.77,24.54 57.3,24.54 56.39,23.62 B8ALT.B(-)
L8  (via drill 0.3)
  Top 0.152: v21.95,25.3 21.34,24.69 B5.G(-)
  Bottom 0.152: R12.1 26.67,25.3 v21.95,25.3
L8G
  Top 0.152: B10ALT.G(-) 70.1,27.43 73.3,30.63 74.37,30.63 75.13,31.39 77.72,31.39 77.72,31.24 80.62,28.35 83.36,28.35 83.36,24.69 82.3,23.62 B10.G(-)
  Bottom 0.152: B10.G(-) 82.3,23.32 83.52,22.1 83.67,22.1 84.12,21.64 R26.1
L9  (via drill 0.3)
  Top 0.152: v29.57,27.28 29.57,24.38 28.8,23.62 v28.8,22.71
  Bottom 0.152: v29.57,27.28 25.45,27.28 25.45,26.52 R11.1 | v28.8,22.71 24.08,22.71 22.4,24.38 20.57,24.38 19.81,23.62 B5.R(-)
L9R
  Top 0.152: B10ALT.R(-) 71.63,27.43 75.29,31.09 77.42,31.09 77.42,28.35 76.81,27.74 76.81,26.82 79.25,24.38 80.31,24.38 80.31,24.08 80.77,23.62 B10.R(-)
  Bottom 0.152: R25.1 84.12,24.23 83.97,24.38 81.53,24.38 80.77,23.62 B10.R(-)
L10  (via drill 0.3)
  Top 0.152: v38.25,25.6 36.58,23.93 B6.G(-)
  Bottom 0.152: R10.1 41.91,25.6 v38.25,25.6
L10B  (via drill 0.3)
  Top 0.152: v80.77,24.69 B10.B(-)
  Bottom 0.152: R24.1 84.28,22.86 84.73,23.32 84.89,23.32 85.04,23.47 85.04,24.99 82.91,24.99 82.6,24.69 v80.77,24.69 72.69,24.69 71.63,23.62 B10ALT.B(-)
L11  (via drill 0.3)
  Top 0.152: v42.37,25.3 39.62,28.04 37.64,28.04 37.64,26.21 35.05,23.62 B6.R(-)
  Bottom 0.152: v42.37,25.3 43.13,25.3 43.13,26.36 R9.1
L11G
  Top 0.152: B9.G(-) 82.3,7.32 80.77,7.32 77.88,4.42 75.74,4.42 74.98,5.18 74.98,6.1 75.59,6.71 75.59,9.14 73,9.14 70.1,12.04 B9ALT.G(-)
  Bottom 0.152: R23.1 84.12,7.62 83.52,8.23 82.3,8.23 B9.G(-)
L12
  Bottom 0.152: R8.1 45.41,22.86 45.72,22.55 50.9,22.55 51.82,23.47 B7.G(-)
L12R  (via drill 0.3)
  Top 0.152: v78.33,10.97 80.77,8.53 B9.R(-)
  Bottom 0.152: R22.1 84.12,6.4 83.67,6.86 82.14,6.86 80.77,8.23 B9.R(-) | v78.33,10.97 72.69,10.97 71.63,12.04 B9ALT.R(-)
L13
  Bottom 0.152: R7.1 45.41,24.23 45.57,24.38 49.53,24.38 50.29,23.62 B7.R(-)
L13B  (via drill 0.3)
  Top 0.152: v80.77,9.45 B9.B(-)
  Bottom 0.152: 80.77,9.14 72.39,9.14 71.63,8.38 B9ALT.B(-) | 80.77,9.14 83.97,9.14 84.12,8.99 R21.1 | 80.77,9.14 v80.77,9.45
L14
  Bottom 0.152: R6.1 65.53,29.11 64.62,28.19 55.63,28.19 54.86,27.43 B8ALT.G(-) 54.86,27.28 55.47,26.67 55.63,26.67 55.63,25.15 55.17,24.69 53.8,24.69 53.8,23.16 54.41,22.55 66.14,22.55 67.06,23.47 B8.G(-)
L15  (via drill 0.3)
  Top 0.152: v66.75,22.25 65.53,23.47 B8.R(-) 65.53,25.15 v62.79,25.15
  Bottom 0.152: v66.75,22.25 66.29,22.25 65.68,21.64 R5.1 | v62.79,25.15 62.64,24.99 58.67,24.99 56.39,27.28 B8ALT.R(-)
N$2  (via drill 0.3)
  Top 0.152: v83.97,19.81 v87.02,22.86 | v64.01,20.57 61.57,23.01 v61.57,25.6
  Bottom 0.152: v87.02,22.86 89.15,22.86 89.15,23.62 IC3.13 | v83.97,19.81 83.67,20.12 77.11,20.12 76.66,19.66 74.52,19.66 74.07,20.12 69.49,20.12 69.04,19.66 66.9,19.66 65.99,20.57 v64.01,20.57 | v61.57,25.6 61.72,25.76 63.55,25.76 63.86,25.45 R27.2
N$3  (via drill 0.3)
  Top 0.152: v78.79,13.41 v87.63,22.25 | v62.94,14.78 61.57,16.15 v61.57,18.59
  Bottom 0.152: v87.63,22.25 89.76,22.25 89.76,23.62 IC3.12 | v78.79,13.41 67.67,13.41 66.29,14.78 v62.94,14.78 | v61.57,18.59 60.05,20.12 54.25,20.12 53.8,19.66 51.66,19.66 50.6,20.73 44.5,20.73 43.74,21.49 R28.2
N$4  (via drill 0.3)
  Top 0.152: v4.42,29.11 5.49,30.18 v5.49,32.16 | v38.25,33.98 39.17,34.9 53.65,34.9 v53.65,32.77 | v59.74,32 59.74,28.35 60.35,27.74 60.35,21.95 59.74,21.34 v59.74,13.87
  Bottom 0.152: v4.42,29.11 3.5,29.11 IC2.13 | v5.49,32.16 6.71,33.38 12.34,33.38 12.95,33.98 21.95,33.98 22.55,33.38 24.23,33.38 24.84,33.98 v38.25,33.98 | v53.65,32.77 58.98,32.77 v59.74,32 | v59.74,13.87 60.2,13.41 63.4,13.41 63.86,13.87 R13.2
N$5  (via drill 0.3)
  Top 0.152: v2.44,28.19 0.76,26.52 0.76,8.99 v7.77,1.98 | v12.04,1.37 13.87,3.2 v13.87,3.35 | v16.46,6.1 v14.63,4.27
  Bottom 0.152: v2.44,28.19 3.35,28.19 IC2.12 | v7.77,1.98 8.38,1.37 v12.04,1.37 | v13.87,3.35 13.87,4.27 v14.63,4.27 | v16.46,6.1 16.76,6.4 21.34,6.4 21.49,6.25 35.05,6.25 36.12,7.32 38.71,7.32 39.62,8.23 43.74,8.23 44.04,7.92 45.57,7.92 46.79,9.14 52.58,9.14 54.86,6.86 63.4,6.86 63.86,6.4 R14.2
N$6  (via drill 0.3)
  Top 0.152: v66.29,24.38 65.84,24.84 65.84,25.3 64.77,26.36 61.57,26.36 61.57,28.8 62.18,29.41 62.18,30.33 59.74,32.77 57.15,32.77 v57.15,31.55
  Bottom 0.152: v66.29,24.38 67.51,24.38 69.34,22.55 76.66,22.55 78.49,20.73 90.37,20.73 90.37,23.62 IC3.11 | v57.15,31.55 53.95,28.35 46.33,28.35 45.26,27.28 41.3,27.28 40.54,28.04 R29.2
N$7  (via drill 0.3)
  Top 0.152: v12.95,29.72 v12.19,30.48 | v25.91,30.63 26.82,29.72 26.82,9.3 31.09,5.03 38.86,5.03 38.86,4.12 40.23,2.74 44.35,2.74 v44.35,5.49
  Bottom 0.152: v12.19,30.48 12.04,30.33 8.99,30.33 6.55,27.89 3.66,27.89 3.5,27.74 IC2.11 | v12.95,29.72 14.33,31.09 23.77,31.09 24.23,30.63 v25.91,30.63 | v44.35,5.49 45.11,6.25 46.02,6.25 R15.2
N$9  (via drill 0.3)
  Top 0.152: v6.71,27.28 7.77,28.35 7.77,33.07 9.91,35.2 36.73,35.2 36.73,29.57 37.64,28.65 43.59,28.65 43.59,20.12 44.5,19.2 44.5,8.99 45.11,8.38 v45.11,5.49
  Bottom 0.152: v6.71,27.28 3.66,27.28 3.5,27.13 IC2.10 | v45.11,5.49 45.41,5.18 46.02,5.18 R16.2
N$10  (via drill 0.3)
  Top 0.152: v4.42,26.21 3.96,25.76 3.96,12.19 v4.72,11.43 | v17.68,5.79 v13.87,9.6 | v43.59,5.64 44.2,6.25 v44.2,8.53
  Bottom 0.152: v4.42,26.21 3.66,26.21 3.5,26.36 IC2.9 | v4.72,11.43 5.18,10.97 11.73,10.97 13.11,9.6 v13.87,9.6 | v17.68,5.79 17.98,5.49 36.12,5.49 36.27,5.33 41.6,5.33 41.91,5.64 v43.59,5.64 | v44.2,8.53 43.74,8.99 43.28,8.99 R17.2
N$11  (via drill 0.3)
  Top 0.152: v2.44,25.6 1.83,24.99 1.83,11.73 3.05,10.52 3.05,7.47 v8.53,1.98 | v16.31,1.83 17.22,2.74 17.22,4.27 20.27,7.32 23.47,7.32 v23.47,8.53
  Bottom 0.152: v2.44,25.6 3.35,25.6 IC2.8 | v8.53,1.98 16.15,1.98 v16.31,1.83 | v23.47,8.53 23.77,8.23 28.5,8.23 29.11,8.84 31.24,8.84 32.31,9.91 41.3,9.91 41.91,9.3 R18.2
N$12  (via drill 0.3)
  Top 0.152: v19.05,18.75 22.4,18.75 22.4,20.27 v22.25,20.42 | v28.04,20.42 29.57,18.9 29.57,15.39 29.26,15.09 29.26,14.17 29.57,13.87 v29.57,9.75
  Bottom 0.152: v19.05,18.75 16.31,18.75 14.94,20.12 6.86,20.12 6.86,22.1 4.12,24.84 3.66,24.84 3.5,24.99 IC2.7 | v28.04,20.42 v22.25,20.42 | v29.57,9.75 28.8,9.75 28.65,9.91 27.28,9.91 26.67,9.3 R19.2
N$13  (via drill 0.3)
  Top 0.152: v91.29,24.84 91.75,25.3 v91.75,32.46 | v44.81,31.85 v46.94,33.98 | v39.47,29.57 v40.39,30.48
  Bottom 0.152: v91.29,24.84 91.14,24.84 91.14,23.77 IC3.10 | v91.75,32.46 90.83,33.38 54.25,33.38 53.65,33.98 v46.94,33.98 | v44.81,31.85 43.43,30.48 v40.39,30.48 | v39.47,29.57 38.25,28.35 28.19,28.35 28.04,28.19 R30.2
N$14  (via drill 0.3)
  Top 0.152: v67.67,22.1 64.62,19.05 64.62,15.54 61.57,12.5 v61.57,10.36
  Bottom 0.152: v67.67,22.1 76.66,22.1 78.33,20.42 91.59,20.42 91.59,23.62 IC3.9 | v61.57,10.36 61.72,10.21 63.86,10.21 R31.2
N$15  (via drill 0.3)
  Top 0.152: v85.34,25.45 83.21,23.32 83.21,18.9 76.81,12.5 v76.81,7.47
  Bottom 0.152: v85.34,25.45 86.26,26.36 92.35,26.36 92.35,23.77 IC3.8 | v76.81,7.47 76.2,6.86 68.12,6.86 67.06,5.79 67.06,2.74 54.86,2.74 54.25,3.35 51.82,3.35 51.21,2.74 47.24,2.74 46.18,3.81 R32.2
N$16  (via drill 0.3)
  Top 0.152: v92.96,25.76 92.35,26.36 92.35,32.61 91.9,33.07 81.84,33.07 v81.84,32.77 | v41.91,23.93 41.76,23.77 41.76,17.83 41.45,17.53 41.45,17.22 41.76,16.92 41.76,11.12 v39.62,8.99
  Bottom 0.152: v92.96,25.76 92.96,23.77 IC3.7 | v81.84,32.77 62.94,32.77 61.57,31.39 59.59,31.39 56.69,28.5 54.56,28.5 52.27,26.21 44.5,26.21 43.28,24.99 42.98,24.99 v41.91,23.93 | v39.62,8.99 40.54,8.99 R33.2
N$17
  Bottom 0.152: IC3.6 93.57,23.62 93.57,22.55 92.35,22.55 91.9,22.1 91.9,20.12 85.04,20.12 82.45,17.53 68.58,17.53 66.45,15.39 61.87,15.39 61.42,15.85 59.28,15.85 58.83,15.39 55.47,15.39 53.34,17.53 46.94,17.53 43.43,14.02 39.17,14.02 38.56,13.41 30.02,13.41 29.11,14.33 28.8,14.33 28.35,13.87 28.35,12.34 28.5,12.34 30.18,10.67 30.18,9.14 28.04,9.14 R34.2
N$18  (via drill 0.3)
  Top 0.152: v87.78,29.26 88.24,28.8 v88.24,21.64
  Bottom 0.152: v87.78,29.26 88.09,29.26 88.39,29.57 IC3.15 | v88.24,21.64 85.95,21.64 R26.2
N$19  (via drill 0.3)
  Top 0.152: v15.85,8.99 v15.85,10.21
  Bottom 0.152: v15.85,10.21 13.26,12.8 1.52,12.8 1.52,23.16 2.59,24.23 3.2,24.23 3.35,24.38 IC2.6 | v15.85,8.99 16,9.14 23.62,9.14 23.77,8.99 25.3,8.99 R20.2
N$20  (via drill 0.3)
  Top 0.152: v10.97,29.72 10.97,34.14 11.43,34.59 15.24,34.59 v15.24,33.07 | v16.46,32 16.46,28.35 15.85,27.74 15.85,26.82 16.31,26.36 22.86,26.36 22.86,27.58 23.93,28.65 v24.38,28.65
  Bottom 0.152: v10.97,29.72 9.3,29.72 IC2.15 | v15.24,33.07 16.31,32 v16.46,32 | v24.38,28.65 24.69,28.96 26.06,28.96 26.67,28.35 R12.2
N$21  (via drill 0.3)
  Top 0.152: v20.73,28.8 22.25,28.8 v22.25,28.04
  Bottom 0.152: v20.73,28.8 17.37,28.8 17.22,28.65 14.78,28.65 14.48,28.96 9.3,28.96 IC2.16 | v22.25,28.04 25.3,28.04 R11.2
N$22  (via drill 0.3)
  Top 0.152: v10.97,28.35 11.58,28.96 v11.58,33.98 | v41.91,29.26 v41.91,34.29
  Bottom 0.152: v10.97,28.35 9.3,28.35 IC2.17 | v11.58,33.98 11.89,34.29 22.1,34.29 22.71,33.68 24.08,33.68 24.99,34.59 41.6,34.59 v41.91,34.29 | R10.2 v41.91,29.26
N$23  (via drill 0.3)
  Top 0.152: v10.36,30.94 v10.36,27.74 | v39.62,30.48 v39.62,33.38
  Bottom 0.152: v10.36,27.74 9.3,27.74 IC2.18 | v10.36,30.94 13.11,33.68 21.79,33.68 22.4,33.07 24.38,33.07 24.99,33.68 37.8,33.68 38.1,33.38 v39.62,33.38 | v39.62,30.48 40.23,29.87 42.06,29.87 43.13,28.8 43.13,28.19 R9.2
N$24  (via drill 0.3)
  Top 0.152: v13.41,27.13 14.02,27.74 14.02,30.33 18.59,34.9 36.42,34.9 36.42,29.41 37.49,28.35 42.98,28.35 42.98,23.77 v42.52,23.32
  Bottom 0.152: v13.41,27.13 9.3,27.13 IC2.19 | v42.52,23.32 42.98,22.86 R8.2
N$25  (via drill 0.3)
  Top 0.152: v12.04,26.52 13.72,28.19 13.72,30.79 v16,33.07 | v43.89,32.77 44.2,32.46 v44.2,25.15
  Bottom 0.152: v12.04,26.52 9.3,26.52 IC2.20 | v16,33.07 21.95,33.07 22.25,32.77 24.54,32.77 25.15,33.38 37.64,33.38 38.25,32.77 v43.89,32.77 | v44.2,25.15 44.2,24.23 43.74,24.23 R7.2
N$26  (via drill 0.3)
  Top 0.152: v21.79,32.46 v17.53,28.19 | v37.34,32.77 39.01,32.77 v39.01,33.98 | v61.27,32 62.79,30.48 v62.79,29.57
  Bottom 0.152: v17.53,28.19 16.31,28.19 13.87,25.76 9.3,25.76 IC2.21 | v21.79,32.46 24.69,32.46 24.99,32.77 v37.34,32.77 | v39.01,33.98 41.45,33.98 42.06,33.38 53.8,33.38 54.1,33.07 60.2,33.07 v61.27,32 | v62.79,29.57 63.09,29.26 63.86,29.26 R6.2
N$27  (via drill 0.3)
  Top 0.152: v10.36,25.15 11.43,26.21 11.43,28.04 12.19,28.8 v12.19,29.72 | v24.23,31.39 26.52,29.11 26.52,22.4 v26.21,22.1 | v52.43,22.1 v49.53,19.2
  Bottom 0.152: v10.36,25.15 9.3,25.15 IC2.22 | v12.19,29.72 13.87,31.39 v24.23,31.39 | v26.21,22.1 27.28,21.03 29.26,21.03 31.7,18.59 39.62,18.59 40.23,17.98 44.81,17.98 46.02,19.2 v49.53,19.2 | v52.43,22.1 63.4,22.1 63.86,21.64 R5.2
N$28  (via drill 0.3)
  Top 0.152: v87.63,25.15 v87.63,28.5
  Bottom 0.152: v87.63,28.5 89,28.5 89,29.57 IC3.16 | v87.63,25.15 86.72,24.23 85.95,24.23 R25.2
N$29  (via drill 0.3)
  Top 0.152: v86.87,28.04 87.02,27.89 v87.02,23.77
  Bottom 0.152: v86.87,28.04 87.02,27.89 89.76,27.89 89.76,29.57 IC3.17 | v87.02,23.77 86.11,22.86 R24.2
N$30  (via drill 0.3)
  Top 0.152: v87.78,30.33 88.54,29.57 88.54,22.1 88.85,21.79 88.85,12.95 87.02,11.12 v87.02,8.53
  Bottom 0.152: v87.78,30.33 90.37,30.33 90.37,29.72 IC3.18 | v87.02,8.53 86.11,7.62 R23.2
N$31  (via drill 0.3)
  Top 0.152: v90.98,32.16 90.98,25.3 90.53,24.84 90.53,9.91 v87.02,6.4
  Bottom 0.152: v90.98,32.16 91.14,32 91.44,32 91.44,30.48 91.29,30.33 91.14,30.33 91.14,29.72 IC3.19 | v87.02,6.4 85.95,6.4 R22.2
N$32  (via drill 0.3)
  Top 0.152: v90.37,28.04 90.22,27.89 90.22,10.36 v89.31,9.45
  Bottom 0.152: v90.37,28.04 91.59,28.04 91.59,29.57 IC3.20 | v89.31,9.45 86.41,9.45 85.95,8.99 R21.2

### Text on the board
_bsilk: v07-01-13 | BI10-2x5RGB | SKAARHOJ 2013 | GITHUB: SKAARHOJ-Open-Engineering